# Altium schematic sheet DE-180824.SchDoc: DimmerBoard
size A4; Author: eldar6776@hotmail.com; DrawnBy: Eldar Dedic; Organization: JUBERA d.o.o.; Address1: Braće Mulić 81; Address2: 71000 Sarajevo; Address3: Federacija BiH; Address4: Bosna i Hercegovina; DocumentNumber: DE-180824; Revision: 001; SheetNumber: 1; SheetTotal: 2; SPICEModelCacheBVBUIEPD: <root> / <DocumentId>BVBUIEPD</DocumentId> / </root>
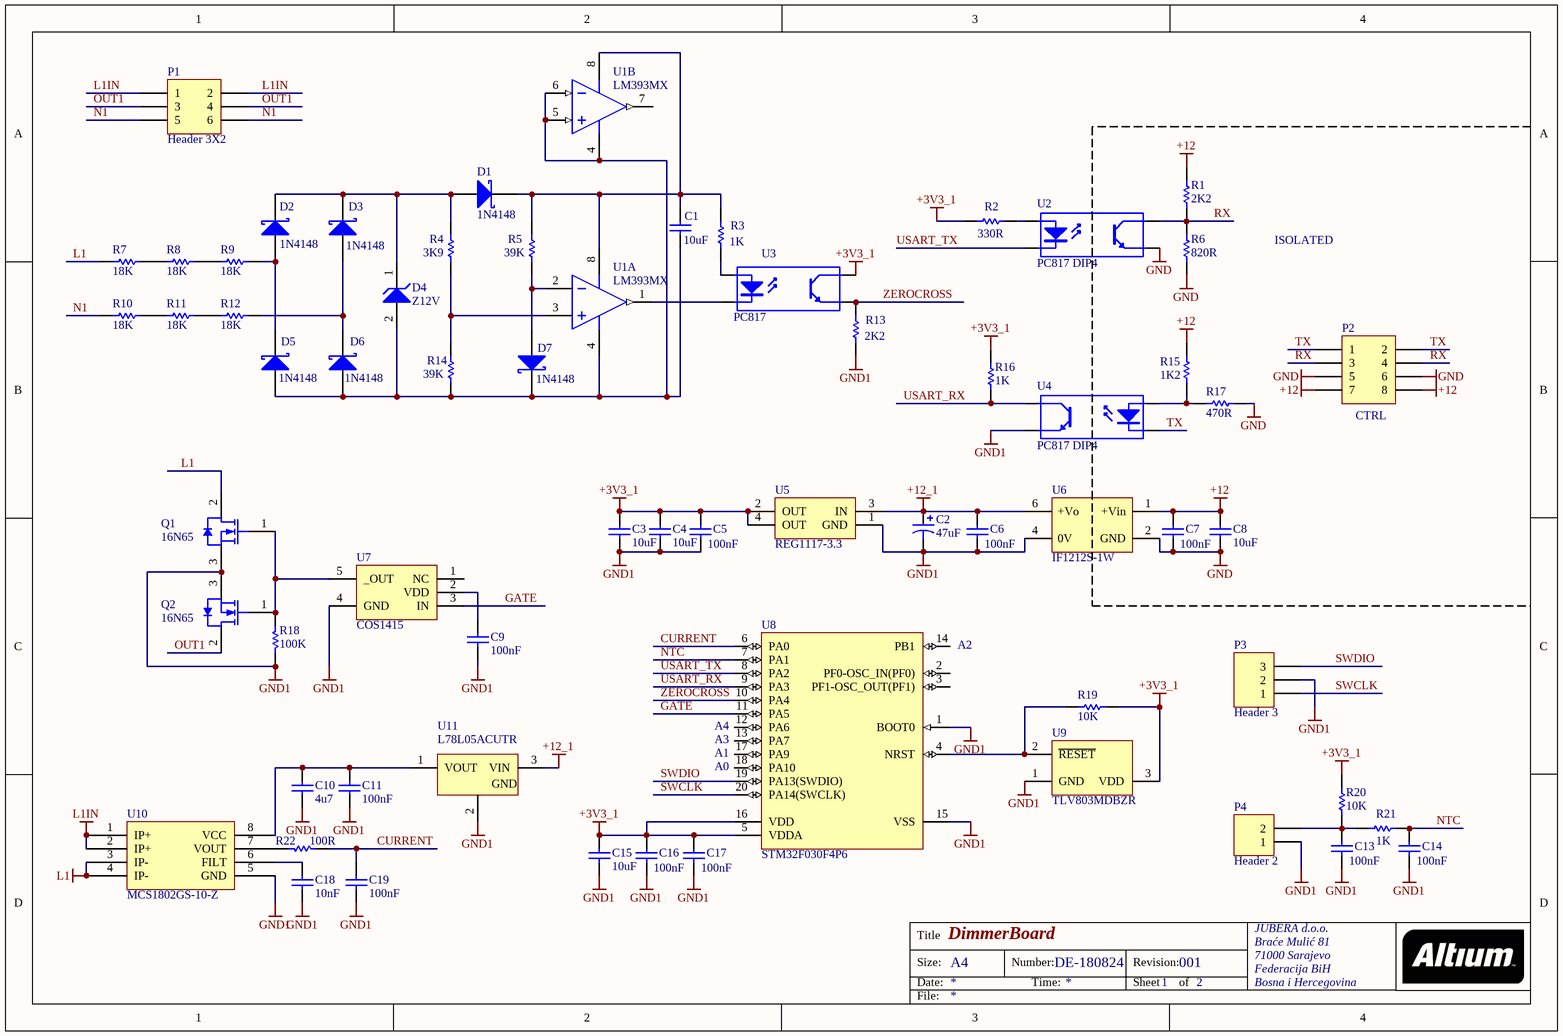
[diagram p0: DE-180824.SchDoc]

## Parts
C1  10uF  [0805]
C2  47uF  [H]
C3  value 10uF  [0805]  (hidden comment: C0805)
C4  value 10uF  [0805]  (hidden comment: C0805)
C5  value 100nF  [0603]  (hidden comment: C0603)
C6  value 100nF  [0603]  (hidden comment: C0603)
C7  value 100nF  [0603]  (hidden comment: C0603)
C8  value 10uF  [0805]  (hidden comment: C0805)
C9  value 100nF  [0603]  (hidden comment: C0603)
C10  value 4u7  [0805]  (hidden comment: C0805)
C11  value 100nF  [0603]  (hidden comment: C0603)
C13  value 100nF  [0603]  (hidden comment: C0603)
C14  value 100nF  [0603]  (hidden comment: C0603)
C15  value 10uF  [0805]  (hidden comment: C0805)
C16  value 100nF  [0603]  (hidden comment: C0603)
C17  value 100nF  [0603]  (hidden comment: C0603)
C18  value 10nF  [0603]  (hidden comment: C0603)
C19  value 100nF  [0603]  (hidden comment: C0603)
D1  1N4148  [SOD323]
D2  1N4148  [SOD323]
D3  1N4148  [SOD323]
D4  Z12V  [ONSC-SOD-323-2-477-02_V]
D5  1N4148  [SOD323]
D6  1N4148  [SOD323]
D7  1N4148  [SOD323]
P1  Header 3X2  [HDR2X3]
P2  CTRL  [HDR2X4]
P3  Header 3  [HDR1X3]
P4  Header 2  [HDR1X2]
Q1  16N65  [INF-PG-TO263-3-2_N]
Q2  16N65  [INF-PG-TO263-3-2_N]
R1  2K2  [ERA-0603]
R2  330R  [ERA-0603]
R3  1K  [ERA-0603]
R4  3K9  [ERA-0603]
R5  39K  [ERA-0603]
R6  820R  [ERA-0603]
R7  18K  [ERA-0805]
R8  18K  [ERA-0805]
R9  18K  [ERA-0805]
R10  18K  [ERA-0805]
R11  18K  [ERA-0805]
R12  18K  [ERA-0805]
R13  2K2  [ERA-0603]
R14  39K  [ERA-0603]
R15  1K2  [ERA-0603]
R16  1K  [ERA-0603]
R17  470R  [ERA-0603]
R18  100K  [ERA-0805]
R19  10K  [ERA-0603]
R20  10K  [ERA-0603]
R21  1K  [ERA-0603]
R22  100R  [ERA-0603]
U1  LM393MX  [M08A_N]  (parts A,B of 2)
U2  PC817 DIP4  [DIP-4]
U3  PC817  [DIP-4]
U4  PC817 DIP4  [DIP-4]
U5  REG1117-3.3  [ZZ311]
U6  IF1212S-1W  [IF1212S-1W]
U7  COS1415  [SOT23-5]
U8  STM32F030F4P6  [STM-TSSOP20_N]
U9  TLV803MDBZR  [DBZ3_N]
U10  MCS1802GS-10-Z  [SOIC-SN8_N]
U11  L78L05ACUTR  [SOT-89_N]

## Nets
+3V3_1: C3.2 C4.2 C5.2 C15.2 C16.2 C17.2 R2.2 R16.2 R19.2 R20.2 U3.4(C) U5.2(OUT) U5.4(OUT) U8.5(VDDA) U8.16(VDD) U9.3(VDD)
+12: C7.2 C8.2 P2.7 P2.8 R1.1 R15.1 U6.1(+Vin)
+12_1: C2.1 C6.2 U5.3(IN) U6.6(+Vo) U11.3(VIN)
GND: C7.1 C8.1 P2.5 P2.6 R6.2 R17.2 U2.3(E) U6.2(GND)
GND1: C2.2 C3.1 C4.1 C5.1 C6.1 C9.1 C10.1 C11.1 C13.1 C14.1 C15.1 C16.1 C17.1 C18.1 C19.1 P3.2 P4.1 Q1.3(SOURCE) Q2.3(SOURCE) R13.1 R18.1 U4.3(E) U5.1(GND) U6.4(0V) U7.4(GND) U8.1(BOOT0) U8.15(VSS) U9.1(GND) U10.5(GND) U11.2(GND)
L1: Q1.2(DRAIN) R7.1 U10.3(IP-) U10.4(IP-)
L1IN: P1.1 P1.2 U10.1(IP+) U10.2(IP+)
CURRENT: C19.2 R22.1 U8.6(PA0)
GATE: U7.3(IN) U8.11(PA5)
N1: P1.5 P1.6 R10.1
NTC: C14.2 R21.1 U8.7(PA1)
OUT1: P1.3 P1.4 Q2.2(DRAIN)
RX: P2.3 P2.4 R1.2 R6.1 U2.4(C)
SWCLK: P3.1 U8.20(PA14(SWCLK))
SWDIO: P3.3 U8.19(PA13(SWDIO))
TX: P2.1 P2.2 U4.2(K)
USART_RX: R16.1 U4.4(C) U8.9(PA3)
USART_TX: U2.2(K) U8.8(PA2)
ZEROCROSS: R13.2 U3.3(E) U8.10(PA4)
NetC1_1: C1.1 D4.2(A) D5.2(A) D6.2(A) D7.1(K) R14.1 U1.4(GND) U1.5(INB+) U1.6(INB-)
NetC1_2: C1.2 D1.1(K) R3.2 R5.2 U1.8(V+)
NetC9_2: C9.2 U7.2(VDD)
NetC10_2: C10.2 C11.2 U10.8(VCC) U11.1(VOUT)
NetC13_2: C13.2 P4.2 R20.1 R21.2
NetC18_2: C18.2 U10.6(FILT)
NetD1_2: D1.2(A) D2.1(K) D3.1(K) D4.1(K) R4.2
NetD2_2: D2.2(A) D5.1(K) R9.2
NetD3_2: D3.2(A) D6.1(K) R12.2
NetD7_2: D7.2(A) R5.1 U1.2(INA-)
NetQ1_1: Q1.1(GATE) Q2.1(GATE) R18.2 U7.5(_OUT)
NetR2_1: R2.1 U2.1(A)
NetR3_1: R3.1 U3.1(A)
NetR4_1: R4.1 R14.2 U1.3(INA+)
NetR7_2: R7.2 R8.1
NetR8_2: R8.2 R9.1
NetR10_2: R10.2 R11.1
NetR11_2: R11.2 R12.1
NetR15_2: R15.2 R17.1 U4.1(A)
NetR19_1: R19.1 U8.4(NRST) U9.2(~{RESET})
NetR22_2: R22.2 U10.7(VOUT)
NetU1_1: U1.1(OUTA) U3.2(K)

Not connected (* = marked no-connect by the designer): U1 7(OUTB); U7 1(NC); U8 2(PF0-OSC_IN(PF0)) 3(PF1-OSC_OUT(PF1)) 12(PA6) 13(PA7) 14(PB1) 17(PA9) 18(PA10)

## Notes on the sheet
- ISOLATED
- (near U8) A2
- (near U8) A4
- (near U8) A3
- (near U8) A1
- (near U8) A0
- Title
- Size:
- Date:
- Number:
- Time:
- Revision:
- Sheet
- of
- File:

## Library data of the parts
C1 C3 C4 C8 C10 C15 = C0805: Ceramic Chip Capacitor - Standard; Note: Footprint corresponds to dimensions for bulk cassette packaging. This case size has tightened tolerances.; Published: 17-Jul-2002; LatestRevisionDate: 19-Mar-2004; LatestRevisionNote: Silkscreen size reduced.; DatasheetDocument: Mar-2001; PackageDocument: Mar-2001; PackageReference: 0805; Publisher: Altium Limited; Code_JEITA: 0805; Code_IPC: 2012[0805]; ComponentLink1Description: Manufacturer Link; ComponentLink1URL: http://www.kemet.com/; ComponentLink2Description: Datasheet; ComponentLink2URL: http://www.kemet.com/kemet/web/homepage/kechome.nsf/vapubfilesname/F3102TA.pdf/$file/F3102TA.pdf
  C1: Value: 10uF
C2 = 194D476X0015H2: Midget Conformal Coated Solid Tantalum Chip Capacitor: 47uF, 20% Tolerance, 15 WVDC @ +85°C, Surge = 20V; Note: See Data Sheet for full range of components; Published: 19-Mar-2004; DatasheetDocument: 05-Jul-2002; PackageReference: H; Publisher: Altium Limited; ComponentLink1Description: Manufacturer Link; ComponentLink1URL: http://www.vishay.com/; ComponentLink2Description: Datasheet; ComponentLink2URL: http://www.vishay.com/docs/40000/194d.pdf; Value: 47uF
C5-C7 C9 C11 C13 C14 C16-C19 = C0603: Ceramic Chip Capacitor - Standard; Note: Footprint corresponds to dimensions for bulk cassette packaging. This case size has tightened tolerances.; Published: 17-Jul-2002; LatestRevisionDate: 19-Mar-2004; LatestRevisionNote: Silkscreen size reduced.; DatasheetDocument: Mar-2001; PackageDocument: Mar-2001; PackageReference: 0603; Publisher: Altium Limited; Code_JEITA: 0603; Code_IPC: 1608 [0603]; ComponentLink1Description: Manufacturer Link; ComponentLink1URL: http://www.kemet.com/; ComponentLink2Description: Datasheet; ComponentLink2URL: http://www.kemet.com/kemet/web/homepage/kechome.nsf/vapubfilesname/F3102TA.pdf/$file/F3102TA.pdf
D1-D3 D5-D7 = 1PS76SB10: Schottky Barrier Diode; Published: 17-Sep-2003; LatestRevisionDate: 19-Mar-2004; LatestRevisionNote: Silkscreen size reduced.; DatasheetVersion: 14-Oct-1996; PackageVersion: May-1999; PackageReference: SOD323; Publisher: Altium Limited; PackageDescription: SOD-323/SC-76; 2 Leads; Body 1.7 x 1.3 mm, (LxW); ComponentLink1Description: Manufacturer Link; ComponentLink1URL: http://www.semiconductors.philips.com/; ComponentLink2Description: Datasheet; ComponentLink2URL: http://www.semiconductors.philips.com/acrobat/datasheets/1PS76SB10_2.pdf
D4 = SZMM3Z12VT1G: Zener Voltage Regulator, 300 mW, 2-Pin SOD-323, Pb-Free, Tape and Reel; Manufacturer: On Semiconductor; P Max (W): 0.3; VZ Typ (V): 12; DatasheetVersion: Rev. 9; PackageVersion: Rev. H, 03/2007; PackageReference: SOD-323-2-477-02; PackageDescription: 2-Pin SOD, Body 1.7 x 1.25 mm; Supplier 1: Digi-Key; Supplier Part Number 1: SZMM3Z12VT1G-ND; Supplier 2: Mouser; Supplier Part Number 2: 863-SZMM3Z12VT1G; Packing: Tape and Reel; RoHS: Pb-Free; Mounting Technology: Surface Mount; PartNumber: SZMM3Z12VT1G; ComponentLink1Description: Manufacturer URL; ComponentLink1URL: http://www.onsemi.com/; ComponentLink2Description: Datasheet; ComponentLink2URL: http://www.onsemi.cn/pub_link/Collateral/MM3Z2V4T1-D.PDF; ComponentLink3Description: Package Specification; ComponentLink3URL: http://www.onsemi.com/pub_link/Collateral/477-02.PDF.1
P1 = Header 3X2: Header, 3-Pin, Dual row; LatestRevisionDate: 17-Jul-2002; LatestRevisionNote: Re-released for DXP Platform.; Publisher: Altium Limited
P2 = Header 4X2: Header, 4-Pin, Dual row; LatestRevisionDate: 17-Jul-2002; LatestRevisionNote: Re-released for DXP Platform.; Publisher: Altium Limited
P3 = Header 3: Header, 3-Pin; LatestRevisionDate: 17-Jul-2002; LatestRevisionNote: Re-released for DXP Platform.; Publisher: Altium Limited
P4 = Header 2: Header, 2-Pin; LatestRevisionDate: 17-Jul-2002; LatestRevisionNote: Re-released for DXP Platform.; Publisher: Altium Limited
Q1 Q2 = IPB020NE7N3 G: N-Channel OptiMOS 3 Power-Transistor, 75 V VDS, 120 A ID, -55 to 175 degC, PG-TO263-3-2, Reel, Green; Manufacturer: Infineon; Green: TRUE; ID (max): 120 A; IDpuls (max): 480 A; Polarity: N; Ptot (max): 300 W; QG: 155 nC; RDS (on) (max): 2 mOhm; Rth: 0.5 K/W; RthJA (max): 62 K/W; VDS (max): 75 V; VGS(th) (max): 3.8 V; VGS(th) (min): 2.3 V; DatasheetVersion: Rev. 2.2; PackageVersion: Jul-09; PackageReference: PG-TO263-3-2; PackageDescription: 3-Pin Plastic (Green) Transistor Single Outline Package, 10 x 9.25 mm Body, 2.54 mm Pitch; Supplier 1: Mouser; Supplier Part Number 1: 726-IPB020NE7N3GXT; Supplier 2: Digi-Key; Supplier Part Number 2: IPB020NE7N3 GTR-ND; Supplier 3: Digi-Key; Supplier Part Number 3: IPB020NE7N3 GCT-ND; Supplier 4: Digi-Key; Supplier Part Number 4: IPB020NE7N3 GDKR-ND; Halogen-free: TRUE; Packing: Reel; RthJC (max): 0.5 K/W; Mounting Technology: Surface Mount; PartNumber: IPB020NE7N3 G; ComponentLink1Description: Manufacturer URL; ComponentLink1URL: http://www.infineon.com/; ComponentLink2Description: Datasheet; ComponentLink2URL: http://www.infineon.com/dgdl/IPB020NE7N3_Rev2.2.pdf?folderId=db3a304313b8b5a60113cee8763b02d7&fileId=db3a304320d39d590121e31c838554d3; ComponentLink3Description: Package Specification; ComponentLink3URL: http://www.infineon.com/dgdl/BTS141TC_DS_10.pdf?folderId=db3a3043163797a6011667aa084c0e01&fileId=db3a3043242ebc9e01242f43f58b003e&location=en.Products.Automotive_ICs.Smart_High-_and_Low-Side_Switches.HITFET___TEMPFET__-_Smart_Low-Side_Switches.DATASHEET.BTS141TC_DS_10.pdf
R1-R6 R13-R17 R22 = ERAV: Metal Film Thermosensitive Chip Resistor, 0.56 Ohm to 10k Ohm Range, 5% Tolerance, 0603 Size, 0.063 W; Note: If flow soldering, adjust pad width of PCB Footprint to 0.7 - 0.8 times the width of the resistor.; Published: 17-Dec-2003; LatestRevisionDate: 19-Mar-2004; LatestRevisionNote: Silkscreen size reduced.; PackageDocument: Mar-2003; PackageReference: ERA-0603; Publisher: Altium Limited; Code_IPC: 1608 [0603]; ComponentLink1Description: Manufacturer Link; ComponentLink1URL: http://www.panasonic.com/industrial/components/resistive_products.htm; ComponentLink2Description: Datasheet; ComponentLink2URL: http://www.panasonic.com/industrial/components/pdf/AOF0000CE1.pdf
R7-R12 R18 = ERAS: Metal Film Thermosensitive Chip Resistor, 0.56 Ohm to 10k Ohm Range, 5% Tolerance, 0805 Size, 0.1 W; Note: If flow soldering, adjust pad width of PCB Footprint to 0.7 - 0.8 times the width of the resistor.; Published: 17-Dec-2003; LatestRevisionDate: 19-Mar-2004; LatestRevisionNote: Silkscreen size reduced.; PackageDocument: Mar-2003; PackageReference: ERA-0805; Publisher: Altium Limited; Code_IPC: 2012 [0805]; ComponentLink1Description: Manufacturer Link; ComponentLink1URL: http://www.panasonic.com/industrial/components/resistive_products.htm; ComponentLink2Description: Datasheet; ComponentLink2URL: http://www.panasonic.com/industrial/components/pdf/AOF0000CE1.pdf
R19-R21 = ERA3Y: Rectangular Thick Film Chip Resistor, 10 Ohm to 330k Ohm Range, 0.1% and 0.5% Tolerance, 0603 Size, 0.063 W; Note: If flow soldering, adjust pad width of PCB Footprint to 0.7 - 0.8 times the width of the resistor.; Published: 17-Dec-2003; LatestRevisionDate: 19-Mar-2004; LatestRevisionNote: Silkscreen size reduced.; PackageDocument: Mar-2003; PackageReference: ERA-0603; Publisher: Altium Limited; Code_IPC: 1608 [0603]; ComponentLink1Description: Manufacturer Link; ComponentLink1URL: http://www.panasonic.com/industrial/components/resistive_products.htm; ComponentLink2Description: Datasheet; ComponentLink2URL: http://www.panasonic.com/industrial/components/pdf/AOA0000CE8.pdf
U1 = LM393MX: Low Power Low Offset Voltage Dual Comparator, 8-pin Narrow SOIC; Manufacturer: National Semiconductor; PackageTopMarking: NSZXTT*LM*393M; PowerWise: N; High-Reliability: Y; DatasheetVersion: Aug-2002; PackageVersion: revM, May-2009; PackageReference: M08A; PackageDescription: SOIC Narrow, 4.9 x 3.9 x 1.45mm, 8 Lead, 1.27mm Pitch; PartNumber: LM393MX; RoHS: N; PinCount: 8; CompType: Comparator; Code_JEDEC: MS-012-AA; Code_IPC: SOIC127P600-8; ComponentLink1Description: Manufacturer URL; ComponentLink1URL: http://www.national.com/; ComponentLink2Description: LM393 Datasheet; ComponentLink2URL: http://www.national.com/ds/LM/LM393.pdf; ComponentLink3Description: LM393 Web Page; ComponentLink3URL: http://www.national.com/pf/LM/LM393.html; ComponentLink4Description: M08A Package Page; ComponentLink4URL: http://www.national.com/packaging/folders/m08a.html
U2 U4 = PC817 DIP4: 4-Pin Phototransistor Optocoupler; Published: 24-Mar-1999; LatestRevisionDate: 04-Mar-2005; LatestRevisionNote: Sch pins 3 & 4 Swapped.; DatasheetVersion: Nov-2003; PackageReference: DIP-4; Publisher: Altium Limited
U3 = PC817: 4-Pin Phototransistor Optocoupler; Published: 24-Mar-1999; LatestRevisionDate: 04-Mar-2005; LatestRevisionNote: Sch pins 3 & 4 Swapped.; DatasheetVersion: Nov-2003; PackageReference: DIP-4; Publisher: Altium Limited
U5 = REG1117-3.3: 800mA and 1A Low Dropout Positive Regulator 2.85V, 3.3V, 5V, and Adjustable; Published: 8-Jun-2000; LatestRevisionDate: 17-Jul-2002; LatestRevisionNote: Re-released for DXP Platform.; DatasheetVersion: Sep-1997; PackageVersion: revC; PackageReference: ZZ311; Publisher: Altium Limited; PackageDescription: SOT-223/SC-73; 4 Leads; Body 6.7 x 7.3 mm, inc. leads (LxW max); ComponentLink1Description: Manufacturer Link; ComponentLink1URL: http://www.ti.com/; ComponentLink2Description: Datasheet; ComponentLink2URL: http://www-s.ti.com/sc/ds/REG1117.pdf
U6 = IF1212S-1W: 1W isolated dc dc converter
U7 = COS1415: 1.5A Single-Channel / High-Speed Power MOSFETDriver
U8 = STM32F030F4P6: ARM Cortex-M0 32-bit MCU, 16 KB Flash, 4 KB Internal RAM, 15 I/Os, 20-pin TSSOP, -40 to 85 degC, Tube; FLASH Size (Prog) (kB): 16; I/Os (High Current): 15; Internal RAM Size (kB): 4; Operating Frequency(F) (Processor speed) (MHz): 48; Supply Voltage(Vcc) min (V): 2.4; DatasheetVersion: Rev. 1; PackageVersion: Rev. 1, 11/2012; PackageReference: TSSOP20; PackageDescription: 20-Pin Thin Shrink Small Outline Package, 6.5 x 4.4 mm Body, 0.65 mm Pitch; Supplier 1: Digi-Key; Supplier Part Number 1: 497-14044-5-ND; Supplier 2: Newark; Supplier Part Number 2: 06X3648; Supplier 3: Mouser; Supplier Part Number 3: 511-STM32F030F4P6; Core: ARM Cortex-M0; Packing: Tube; Mounting Technology: Surface Mount; PartNumber: STM32F030F4P6; ComponentLink1Description: Manufacturer URL; ComponentLink1URL: http://www.st.com/web/en/home.html; ComponentLink2Description: Datasheet; ComponentLink2URL: http://www.st.com/st-web-ui/static/active/en/resource/technical/document/datasheet/DM00088500.pdf; ComponentLink3Description: Package Specification; ComponentLink3URL: http://www.st.com/st-web-ui/static/active/en/resource/technical/document/datasheet/DM00065136.pdf
U9 = TLV803MDBZR: Voltage Supervisor with Active-Low, Open Drain Reset, 1 Supply Monitored, -40 to 125 degC, 3-pin SOT-23 (DBZ), Green (RoHS & no Sb/Br); Manufacturer: Texas Instruments; # of supplies monitored: 1; Iq(Typ)(uA): 9; Output Driver Type / Reset Output: Active-low, Open-drain; Rating: Catalog; Reset Threshold Accuracy(%): 2; SubFamily: Supervisor and Reset IC; Threshold Voltage 1 (typ)(Typ)(V): 4.38; Time Delay(ms): 200; VCC(Max)(V): 6; VCC(Min)(V): 1.1; DatasheetVersion: SBVS157B; PackageVersion: revB, Apr-2005; PackageReference: DBZ3; PackageDescription: 3-Pin Plastic Small-Outline Package, 0.95 mm Pitch, 2.4 mm Lead Span; Supplier 1: Digi-Key; Supplier Part Number 1: 296-29194-2-ND; Supplier 2: Digi-Key; Supplier Part Number 2: 296-29194-1-ND; Supplier 3: Digi-Key; Supplier Part Number 3: 296-29194-6-ND; Supplier 4: Newark; Supplier Part Number 4: 58T0286; Supplier 5: Mouser; Supplier Part Number 5: 595-TLV803MDBZR; Mounting Technology: Surface Mount; Code_JEDEC: TO-236-AB; PartNumber: TLV803MDBZR; ComponentLink1Description: Datasheet; ComponentLink1URL: http://www.ti.com/general/docs/lit/getliterature.tsp?genericPartNumber=TLV803M&fileType=pdf
U10 = ACS71240
U11 = L78L05ACUTR: Positive Voltage Regulator, 5V, 4-Pin SOT-89, Tape and Reel; DatasheetVersion: Feb-2011; PackageVersion: 2011; PackageReference: SOT-89; PackageDescription: 3-Pin SOT-89 Package 1.5 mm Pitch, 4.1 mm Lead Span; PartNumber: L78L05ACUTR; ComponentLink1Description: Manufacturer URL; ComponentLink1URL: http://www.st.com; ComponentLink2Description: Datasheet; ComponentLink2URL: http://www.st.com/internet/com/TECHNICAL_RESOURCES/TECHNICAL_LITERATURE/DATASHEET/CD00000446.pdf